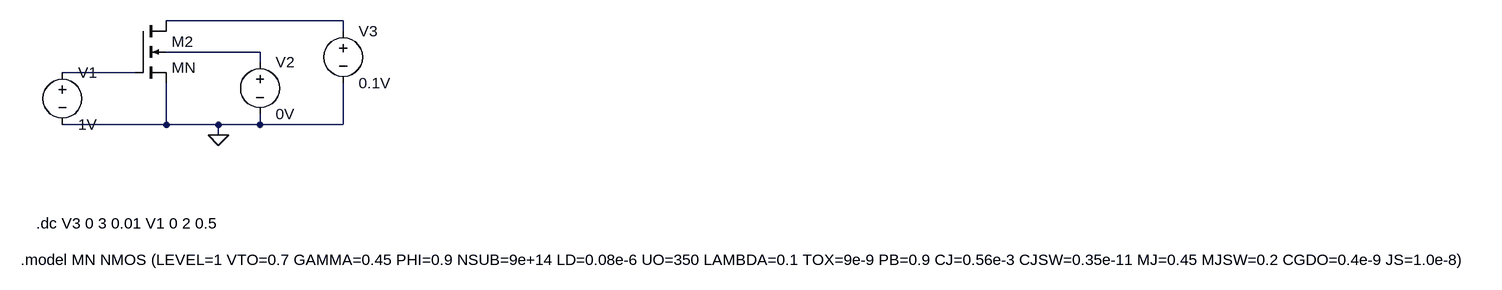
[diagram p0: schematic ex01_nmos.asc]
ex01_nmos.asc, the LTspice schematic file:
Version 4
SHEET 1 2556 680
WIRE 672 160 400 160
WIRE 672 176 672 160
WIRE 544 208 400 208
WIRE 544 224 544 208
WIRE 352 240 240 240
WIRE 400 320 400 256
WIRE 400 320 240 320
WIRE 480 320 400 320
WIRE 544 320 544 304
WIRE 544 320 480 320
WIRE 672 320 672 256
WIRE 672 320 544 320
WIRE 480 336 480 320
FLAG 480 336 0
SYMBOL nmos4 352 160 R0
SYMATTR InstName M2
SYMATTR Value2 l=1u w=20u m=2
SYMATTR Value MN
SYMBOL voltage 240 224 R0
WINDOW 123 0 0 Left 0
WINDOW 39 0 0 Left 0
SYMATTR InstName V1
SYMATTR Value 1V
SYMBOL voltage 544 208 R0
WINDOW 123 0 0 Left 0
WINDOW 39 0 0 Left 0
SYMATTR InstName V2
SYMATTR Value 0V
SYMBOL voltage 672 160 R0
WINDOW 123 0 0 Left 0
WINDOW 39 0 0 Left 0
SYMATTR InstName V3
SYMATTR Value 0.1V
TEXT 176 528 Left 2 !.model MN NMOS (LEVEL=1 VTO=0.7 GAMMA=0.45 PHI=0.9 NSUB=9e+14 LD=0.08e-6 UO=350 LAMBDA=0.1 TOX=9e-9 PB=0.9 CJ=0.56e-3 CJSW=0.35e-11 MJ=0.45 MJSW=0.2 CGDO=0.4e-9 JS=1.0e-8)
TEXT 200 472 Left 2 !.dc V3 0 3 0.01 V1 0 2 0.5

The netlist it stands for:
* ex01_nmos.asc
M2 N001 N003 0 N002 MN l=1u w=20u m=2
V1 N003 0 1V
V2 N002 0 0V
V3 N001 0 0.1V
.model NMOS NMOS
.model PMOS PMOS
.lib standard.mos
.model MN NMOS (LEVEL=1 VTO=0.7 GAMMA=0.45 PHI=0.9 NSUB=9e+14 LD=0.08e-6 UO=350 LAMBDA=0.1 TOX=9e-9 PB=0.9 CJ=0.56e-3 CJSW=0.35e-11 MJ=0.45 MJSW=0.2 CGDO=0.4e-9 JS=1.0e-8)
.dc V3 0 3 0.01 V1 0 2 0.5
.backanno
.end